# Altium schematic sheet HIGH_CURRENT_OUTPUT.SchDoc
size A
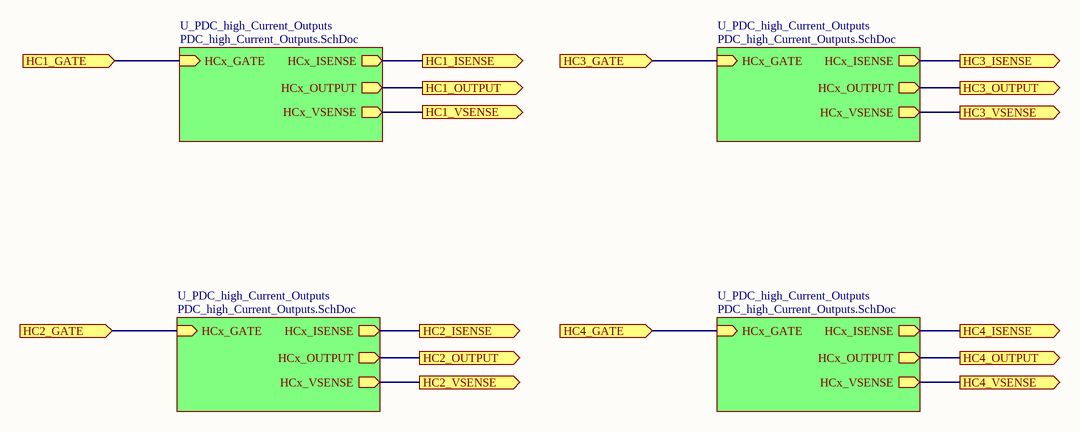
[diagram p0: HIGH_CURRENT_OUTPUT.SchDoc]

## Sub-sheets
U_PDC_high_Current_Outputs = PDC_high_Current_Outputs.SchDoc: HCx_ISENSE (out), HCx_OUTPUT (out), HCx_VSENSE (out), HCx_GATE (in)
U_PDC_high_Current_Outputs = PDC_high_Current_Outputs.SchDoc: HCx_ISENSE (out), HCx_OUTPUT (out), HCx_VSENSE (out), HCx_GATE (in)
U_PDC_high_Current_Outputs = PDC_high_Current_Outputs.SchDoc: HCx_ISENSE (out), HCx_OUTPUT (out), HCx_VSENSE (out), HCx_GATE (in)
U_PDC_high_Current_Outputs = PDC_high_Current_Outputs.SchDoc: HCx_ISENSE (out), HCx_OUTPUT (out), HCx_VSENSE (out), HCx_GATE (in)

## Ports
HC1_GATE (in), HC1_ISENSE (out), HC1_OUTPUT (out), HC1_VSENSE (out), HC2_GATE (in), HC2_ISENSE (out), HC2_OUTPUT (out), HC2_VSENSE (out), HC3_GATE (in), HC3_ISENSE (out), HC3_OUTPUT (out), HC3_VSENSE (out), HC4_GATE (in), HC4_ISENSE (out), HC4_OUTPUT (out), HC4_VSENSE (out)

## Nets
HC1_GATE: port HC1_GATE, sheet U_PDC_high_Current_Outputs/HCx_GATE
HC1_ISENSE: port HC1_ISENSE, sheet U_PDC_high_Current_Outputs/HCx_ISENSE
HC1_OUTPUT: port HC1_OUTPUT, sheet U_PDC_high_Current_Outputs/HCx_OUTPUT
HC1_VSENSE: port HC1_VSENSE, sheet U_PDC_high_Current_Outputs/HCx_VSENSE
HC2_GATE: port HC2_GATE, sheet U_PDC_high_Current_Outputs/HCx_GATE
HC2_ISENSE: port HC2_ISENSE, sheet U_PDC_high_Current_Outputs/HCx_ISENSE
HC2_OUTPUT: port HC2_OUTPUT, sheet U_PDC_high_Current_Outputs/HCx_OUTPUT
HC2_VSENSE: port HC2_VSENSE, sheet U_PDC_high_Current_Outputs/HCx_VSENSE
HC3_GATE: port HC3_GATE, sheet U_PDC_high_Current_Outputs/HCx_GATE
HC3_ISENSE: port HC3_ISENSE, sheet U_PDC_high_Current_Outputs/HCx_ISENSE
HC3_OUTPUT: port HC3_OUTPUT, sheet U_PDC_high_Current_Outputs/HCx_OUTPUT
HC3_VSENSE: port HC3_VSENSE, sheet U_PDC_high_Current_Outputs/HCx_VSENSE
HC4_GATE: port HC4_GATE, sheet U_PDC_high_Current_Outputs/HCx_GATE
HC4_ISENSE: port HC4_ISENSE, sheet U_PDC_high_Current_Outputs/HCx_ISENSE
HC4_OUTPUT: port HC4_OUTPUT, sheet U_PDC_high_Current_Outputs/HCx_OUTPUT
HC4_VSENSE: port HC4_VSENSE, sheet U_PDC_high_Current_Outputs/HCx_VSENSE

## Notes on the sheet
- Title
- Size:
- Date:
- A
- Number:
- Time:
- Revision:
- Sheet
- of
- File: